# Altium schematic sheet ArmDebuger(2-7)-HUB.SchDoc
size 393 x 241 mm
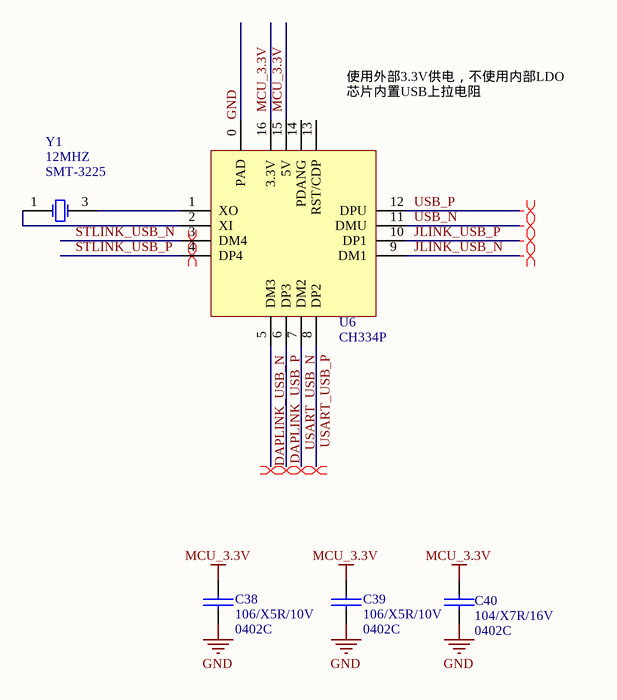
[diagram p0: ArmDebuger(2-7)-HUB.SchDoc]

## Parts
C38  106/X5R/10V  Fp: 0402C  [0402C-SMD-M]
C39  106/X5R/10V  Fp: 0402C  [0402C-SMD-M]
C40  104/X7R/16V  Fp: 0402C  [0402C-SMD-M]
U6  CH334P  [QFN-16]
Y1  12MHZ  Fp: SMT-3225  [CRYSTAL-SMT-3225]

## Nets
GND: C38.2 C39.2 C40.1 U6.0(PAD)
MCU_3.3V: C38.1 C39.1 C40.2 U6.15(5V) U6.16(3.3V)
DAPLINK_USB_N: U6.5(DM3)
DAPLINK_USB_P: U6.6(DP3)
JLINK_USB_N: U6.9(DM1)
JLINK_USB_P: U6.10(DP1)
STLINK_USB_N: U6.3(DM4)
STLINK_USB_P: U6.4(DP4)
USART_USB_N: U6.7(DM2)
USART_USB_P: U6.8(DP2)
USB_N: U6.11(DMU)
USB_P: U6.12(DPU)
NetU6_1: U6.1(XO) Y1.3(OSC2)
NetU6_2: U6.2(XI) Y1.1(OSC1)

Not connected (* = marked no-connect by the designer): U6 13(RST/CDP) 14(PDANG)

## Layout directives
differential pair: DAPLINK_USB_N, DAPLINK_USB_P, JLINK_USB_N, JLINK_USB_P, STLINK_USB_N, STLINK_USB_P, USART_USB_N, USART_USB_P, USB_N, USB_P

## Notes on the sheet
- (near U6) 使用外部3.3V供电，不使用内部LDO
  芯片内置USB上拉电阻

## Library data of the parts
C38 C39 = CAP: LCSC: C29266; P/N: ?
C40 = CAP: P/N: 06075; LCSC: C60474
Y1 = SMD-3225_4P  25MHZ 12PF 10PPM: 贴片晶振; P/N: 10009; LCSC: C133334
U6 = CH334P: Fp: QFN-16; P/N: ?; taobao: https://m.tb.cn/h.5UjuFds?tk=QfBrWaFip8v